# Altium project Manette.PrjPcb
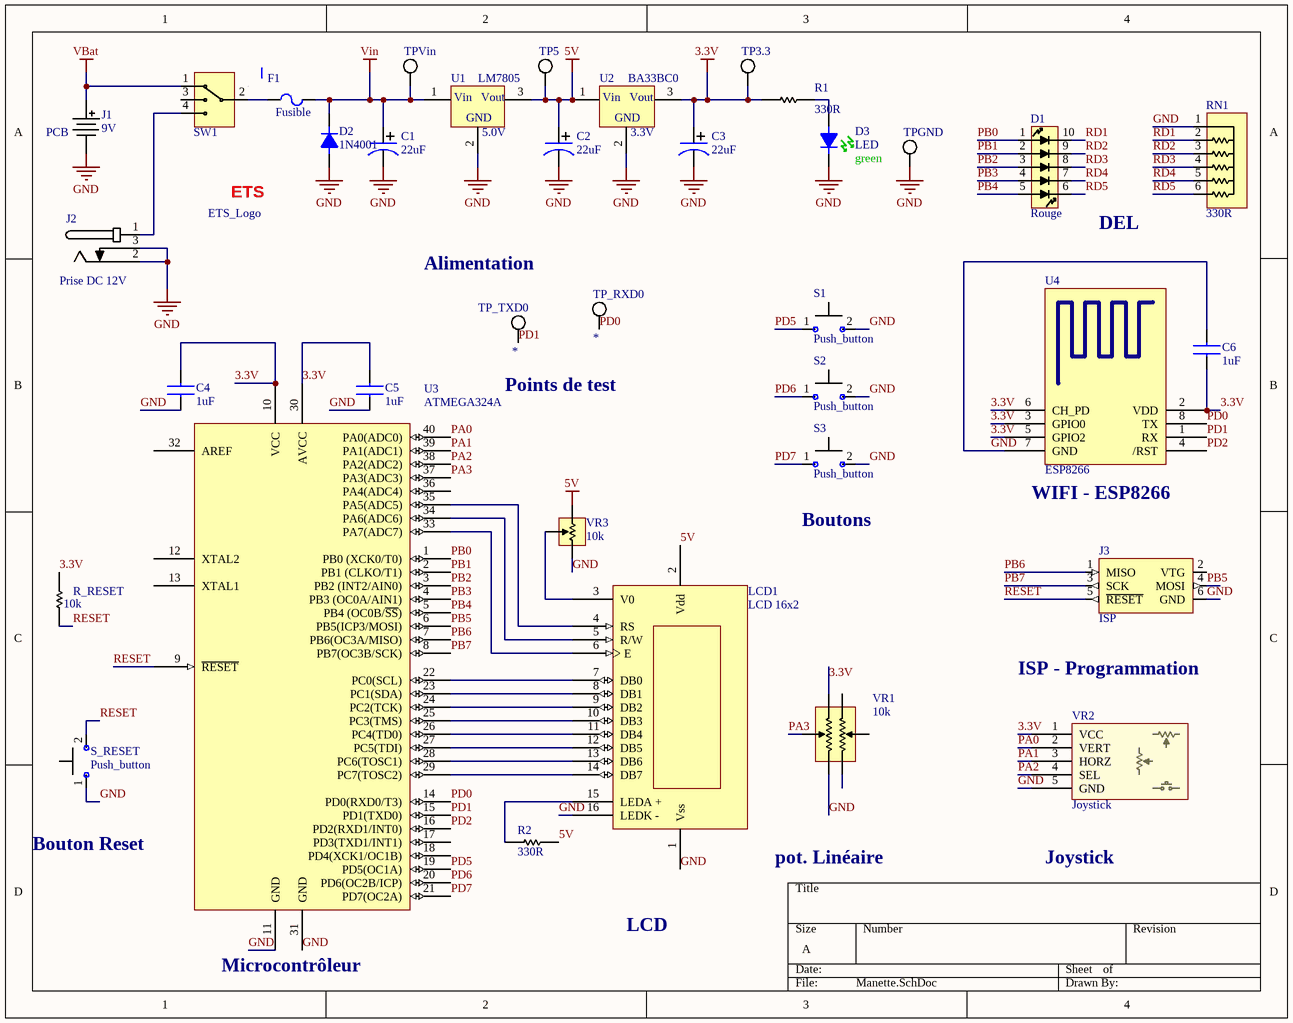
[diagram p0: Manette.SchDoc]
1 sheet, 37 parts. Net scope: global (net labels, ports and power ports of the same name join across sheets).
Board file: Manette.PcbDoc

## Sheet Manette.SchDoc
size A

### Parts
C1  22uF  [Cap Pol (100mil, 80mil)]
C2  22uF  [Cap Pol (100mil, 80mil)]
C3  22uF  [Cap Pol (100mil, 80mil)]
C4  1uF  [Cap UNPOL (200mil, 80mil)]
C5  1uF  [Cap UNPOL (200mil, 80mil)]
C6  1uF  [Cap UNPOL (200mil, 80mil)]
D1  Rouge  [BARGRAPH 5 DEL]
D2  1N4001  [DO-41 (AN) 400mil]
D3  LED  color: green  [LED_GREEN_5mm-100mil]
F1  Fuse  [Fuse]  (value not drawn)
J1  value 9V  [9V PCB Through hole]  (hidden comment: 9 VPCB through hole)
J2  Prise DC 12V  [Prise DC 12V]
J3  ISP  [ISP 2x3 avec detrompeur]
LCD1  LCD 16x2  [LCD 16x2 sans socket]
R1  330R  [Resistor 330 (400mils)]
R2  330R  [Resistor 330 (400mils)]
R_RESET  10k  [Resistor 10k (400mils)]
RN1  value 330R  [RESEAU 5 RESISTANCES]  (hidden comment: Réseau de 5 résistances)
S1  Push_button  [MJTP1230]
S2  Push_button  [MJTP1230]
S3  Push_button  [MJTP1230]
S_RESET  Push_button  [MJTP1230]
SS1  ETS_Logo  [ETS-Logo]
SW1  1825161-1  [1825161-1]  (value not drawn)
TP3.3  *  [HEADER MALE 1X1]  (value not drawn)
TP5  *  [HEADER MALE 1X1]  (value not drawn)
TP_RXD0  *  [HEADER MALE 1X1]
TP_TXD0  *  [HEADER MALE 1X1]
TPGND  *  [HEADER MALE 1X1]  (value not drawn)
TPVin  *  [HEADER MALE 1X1]  (value not drawn)
U1  LM7805  [TO-220FP-3]
U2  BA33BC0  [TO-220FP-3]
U3  ATMEGA324A  [ATMEGA324A-DIP]
U4  ESP8266  [ESP8266]
VR1  10k  [PS45M-0MC2BR10KN]
VR2  Joystick  [JOYSTICK SUR BREAKOUT&SOCKET]
VR3  value 10k  [Trimpot]  (hidden comment: Trimpot)

### Nets
3.3V: C3.2(pos) C4.2 C5.2 C6.1 R1.2 R_RESET.2 TP3.3.1 U2.3(VOUT) U3.10(VCC) U3.30(AVCC) U4.2(VDD) U4.3(GPIO0) U4.5(GPIO2) U4.6(CH_PD) VR1.1(V_HI) VR2.1(VCC)
5V: C2.2(pos) LCD1.2(Vdd) R2.2 TP5.1 U1.3(VOUT) U2.1(VCC) VR3.1(V_HI)
GND: C1.1(neg) C2.1(neg) C3.1(neg) C4.1 C5.1 C6.2 D2.1(A) D3.2(K) J1.2(NEG) J2.2(NEG) J2.3(NEG/NC) J3.6(GND) LCD1.1(Vss) LCD1.16(LEDK_-) RN1.1(COM) S1.2 S2.2 S3.2 S_RESET.1 TPGND.1 U1.2(GND) U2.2(GND) U3.11(GND) U3.31(GND) U4.7(GND) VR1.3(V_LOW) VR2.5(GND) VR3.3(V_LOW)
VBat: J1.1(POS) SW1.1
Vin: C1.2(pos) D2.2(K) F1.2 TPVin.1 U1.1(VCC)
PA0: U3.40(PA0(ADC0)) VR2.2(VERT)
PA1: U3.39(PA1(ADC1)) VR2.3(HORZ)
PA2: U3.38(PA2(ADC2)) VR2.4(SEL)
PA3: U3.37(PA3(ADC3)) VR1.2(V)
PB0: D1.1(A1) U3.1(PB0_(XCK0/T0))
PB1: D1.2(A2) U3.2(PB1_(CLKO/T1))
PB2: D1.3(A3) U3.3(PB2_(INT2/AIN0))
PB3: D1.4(A4) U3.4(PB3_(OC0A/AIN1))
PB4: D1.5(A5) U3.5(PB4_(OC0B/~{SS}))
PB5: J3.4(MOSI) U3.6(PB5(ICP3/MOSI))
PB6: J3.1(MISO) U3.7(PB6(OC3A/MISO))
PB7: J3.3(SCK) U3.8(PB7(OC3B/SCK))
PD0: TP_RXD0.1 U3.14(PD0(RXD0/T3)) U4.8(TX)
PD1: TP_TXD0.1 U3.15(PD1(TXD0)) U4.1(RX)
PD2: U3.16(PD2(RXD1/INT0)) U4.4(/RST)
PD5: S1.1 U3.19(PD5(OC1A))
PD6: S2.1 U3.20(PD6(OC2B/ICP))
PD7: S3.1 U3.21(PD7(OC2A))
RD1: D1.10(K1) RN1.2(R1)
RD2: D1.9(K2) RN1.3(R2)
RD3: D1.8(K3) RN1.4(R3)
RD4: D1.7(K4) RN1.5(R4)
RD5: D1.6(K5) RN1.6(R5)
RESET: J3.5(~{RESET}) R_RESET.1 S_RESET.2 U3.9(~{RESET})
NetD3_1: D3.1(A) R1.1
NetF1_1: F1.1 SW1.2
NetJ2_1: J2.1(POS) SW1.4
NetLCD1_3: LCD1.3(V0) VR3.2(V)
NetLCD1_4: LCD1.4(RS) U3.35(PA5(ADC5))
NetLCD1_5: LCD1.5(R/W) U3.34(PA6(ADC6))
NetLCD1_6: LCD1.6(E) U3.33(PA7(ADC7))
NetLCD1_7: LCD1.7(DB0) U3.22(PC0(SCL))
NetLCD1_8: LCD1.8(DB1) U3.23(PC1(SDA))
NetLCD1_9: LCD1.9(DB2) U3.24(PC2(TCK))
NetLCD1_10: LCD1.10(DB3) U3.25(PC3(TMS))
NetLCD1_11: LCD1.11(DB4) U3.26(PC4(TD0))
NetLCD1_12: LCD1.12(DB5) U3.27(PC5(TDI))
NetLCD1_13: LCD1.13(DB6) U3.28(PC6(TOSC1))
NetLCD1_14: LCD1.14(DB7) U3.29(PC7(TOSC2))
NetLCD1_15: LCD1.15(LEDA_+) R2.1

Not connected (* = marked no-connect by the designer): J3 2(VTG); SW1 3; U3 12(XTAL2) 13(XTAL1) 17(PD3(TXD1/INT1)) 18(PD4(XCK1/OC1B)) 32(AREF) 36(PA4(ADC4)); VR1 4(H_HI) 5(H) 6(H_LOW)

### Notes on the sheet
- (near D1) DEL
- Alimentation
- Points de test
- (near U4) WIFI - ESP8266
- (near S3) Boutons
- ISP - Programmation
- Bouton Reset
- pot. Linéaire
- Joystick
- (near U3) Microcontrôleur
- LCD
- (in symbol 9 VPCB through hole) PCB
- (in symbol ETS_Logo) ETS
- (in symbol Fuse) Fusible
- (in symbol LDO 3.3V) Vin; Vout; 3.3V
- (in symbol LM7805) Vin; Vout; 5.0V

### Library data of the parts
C1-C3 = Electrolytique: Capacitor; Supplier 1: Digi-Key; Supplier Part Number 1: BC2665CT-ND; value: 22uF
C4-C6 = Ceramique: Capacitor; Supplier 1: Digi-Key; Supplier Part Number 1: 445-5331-ND; value: 1uF
D1 = Bargraph 5 DEL: Supplier 1: Digi-Key; Supplier Part Number 1: 1497-1081-5-ND; Value: Rouge
D2 = 1N4001: Diode 1N4001
D3 = LED_verte: DEL verte 5mm (translucide); Supplier 1: Digi-Key; Supplier Part Number 1: 1080-1111-ND
J1 = 9 VPCB through hole: 9V PCB battery holder through hole; Supplier 1: Digi-Key; Supplier Part Number 1: BH9V-PC-ND
J3 = ISP 2x3: Connecteur ISP 2x3; Supplier 1: Digi-Key; Supplier Part Number 1: A26530-18-ND
LCD1 = LCD 16x2: Écran LCD compatible HD44780
R1 R2 = Resistor 330R: Supplier 1: Digi-Key; Supplier Part Number 1: CF14JT330RCT-ND; Value: 330R
R_RESET = Resistor 10k: Résistor 10k; Value: 10k
RN1 = Réseau de 5 résistances: Réseau de 5 résistances pour bus; Supplier 1: Digi-Key; Supplier Part Number 1: 4606X-1-331LF-ND
S1-S3 S_RESET = Push_button: Bouton poussoir tactile
SW1 = 1825161-1: Interrupteur SP3T à glissière; Supplier 1: Digi-Key; Supplier Part Number 1: 450-1611-ND
TP3.3 TP5 TP_RXD0 TP_TXD0 TPGND TPVin = Test point: Point de test; Value: *
U1 = LM7805: Régulateur de tension 5V; Supplier 1: Digi-Key; Supplier Part Number 1: 296-47192-ND
U2 = LDO 3.3V: LDO 3.3V, 1A, 0.3V@200mA, up to 16V (BA33BC0); Supplier 1: Digi-Key; Supplier Part Number 1: BA33BC0T-ND
U3 = ATMEGA324A: Microcontrôleur ATmega324A avec 32K de flash; ComponentLink1Description: Datasheet; ComponentLink1URL: http://www.atmel.com/Images/doc2503.pdf; Supplier 1: Digi-Key; Supplier 2: Digi-Key; Supplier Part Number 1: ATMEGA32L-8PU-ND; Supplier Part Number 2: ED3048-5-ND
VR1 = PS45M-0MC2BR10KN: Potentiomètre à glissière double 10k; Supplier 1: Digi-Key; Supplier Part Number 1: 987-1405-ND; value: 10k
VR2 = Joystick: 2 axes thumb joystick avec bouton; Supplier 1: Digi-Key; Supplier 2: Digi-Key; Supplier Part Number 1: 1568-1526-ND; Supplier Part Number 2: S6103-ND
VR3 = Trimpot: Potentiomètre linéaire; Supplier 1: Digi-Key; Supplier Part Number 1: A105870-ND
F1 = Fuse: Supplier 1: Digi-Key; Supplier Part Number 1: 36-4628-ND
J2 = Prise DC 12V: Supplier 1: Digi-Key; Supplier Part Number 1: CP-102AH-ND; Value: 12V